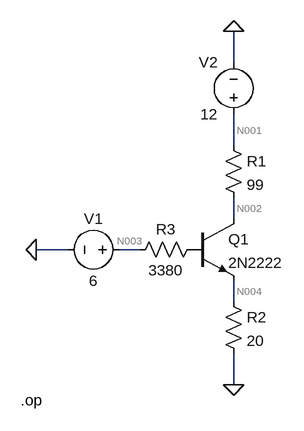
[diagram p0: schematic klucz_1.asc]
klucz_1.asc, the LTspice schematic file:
Version 4
SHEET 1 880 680
WIRE 80 -128 80 -176
WIRE 80 0 80 -48
WIRE 80 112 80 80
WIRE -176 160 -224 160
WIRE -64 160 -96 160
WIRE 80 240 80 208
WIRE 80 368 80 320
FLAG -224 160 0
FLAG 80 -176 0
FLAG 80 368 0
SYMBOL voltage -80 160 R90
WINDOW 0 -32 56 VBottom 2
WINDOW 3 32 56 VTop 2
WINDOW 123 0 0 Left 0
WINDOW 39 0 0 Left 0
SYMATTR InstName V1
SYMATTR Value 6
SYMBOL npn 16 112 R0
SYMATTR InstName Q1
SYMATTR Value 2N2222
SYMBOL res 64 -16 R0
SYMATTR InstName R1
SYMATTR Value 99
SYMBOL res 64 224 R0
SYMATTR InstName R2
SYMATTR Value 20
SYMBOL voltage 80 -32 R180
WINDOW 0 24 96 Left 2
WINDOW 3 24 16 Left 2
WINDOW 123 0 0 Left 0
WINDOW 39 0 0 Left 0
SYMATTR InstName V2
SYMATTR Value 12
SYMBOL res 32 144 R90
WINDOW 0 0 56 VBottom 2
WINDOW 3 32 56 VTop 2
SYMATTR InstName R3
SYMATTR Value 3380
TEXT -248 392 Left 2 !.op

The netlist it stands for:
* klucz_1.asc
V1 N003 0 6
Q1 N002 P001 N004 0 2N2222
R1 N001 N002 99
R2 N004 0 20
V2 N001 0 12
R3 P001 N003 3380
.model NPN NPN
.model PNP PNP
.lib standard.bjt
.op
.backanno
.end

* Results of the author's LTspice run, read from the files saved beside the schematic
* Operating Point:
*   V(n003) = 6 V
*   V(n002) = 2.184 V
*   V(p001) = 2.813 V
*   V(n004) = 2.002 V
*   V(n001) = 12 V
*   Ic(Q1) = 99.15 mA
*   Ib(Q1) = 942.8 µA
*   Ie(Q1) = -100.1 mA
*   I(R3) = -942.8 µA
*   I(R2) = 100.1 mA
*   I(R1) = 99.15 mA
*   I(V2) = -99.15 mA
*   I(V1) = -942.8 µA
* From the log:
*   Semiconductor Device Operating Points:
*                           --- Bipolar Transistors ---
*   Name:       q1
*   Model:    2n2222
*   Ib:       9.43e-04
*   Ic:       9.92e-02
*   Vbe:      8.11e-01
*   Vbc:      6.29e-01
*   Vce:      1.82e-01
*   BetaDC:   1.05e+02
*   Gm:       3.07e+00
*   Rpi:      3.85e+01
*   Rx:       1.00e+01
*   Ro:       4.11e+01
*   Cbe:      1.49e-09
*   Cbc:      3.15e-09
*   Cjs:      0.00e+00
*   BetaAC:   1.18e+02
*   Cbx:      0.00e+00
*   Ft:       1.05e+08